# Altium project TC364_MainBoard_V1.3.PrjPcb
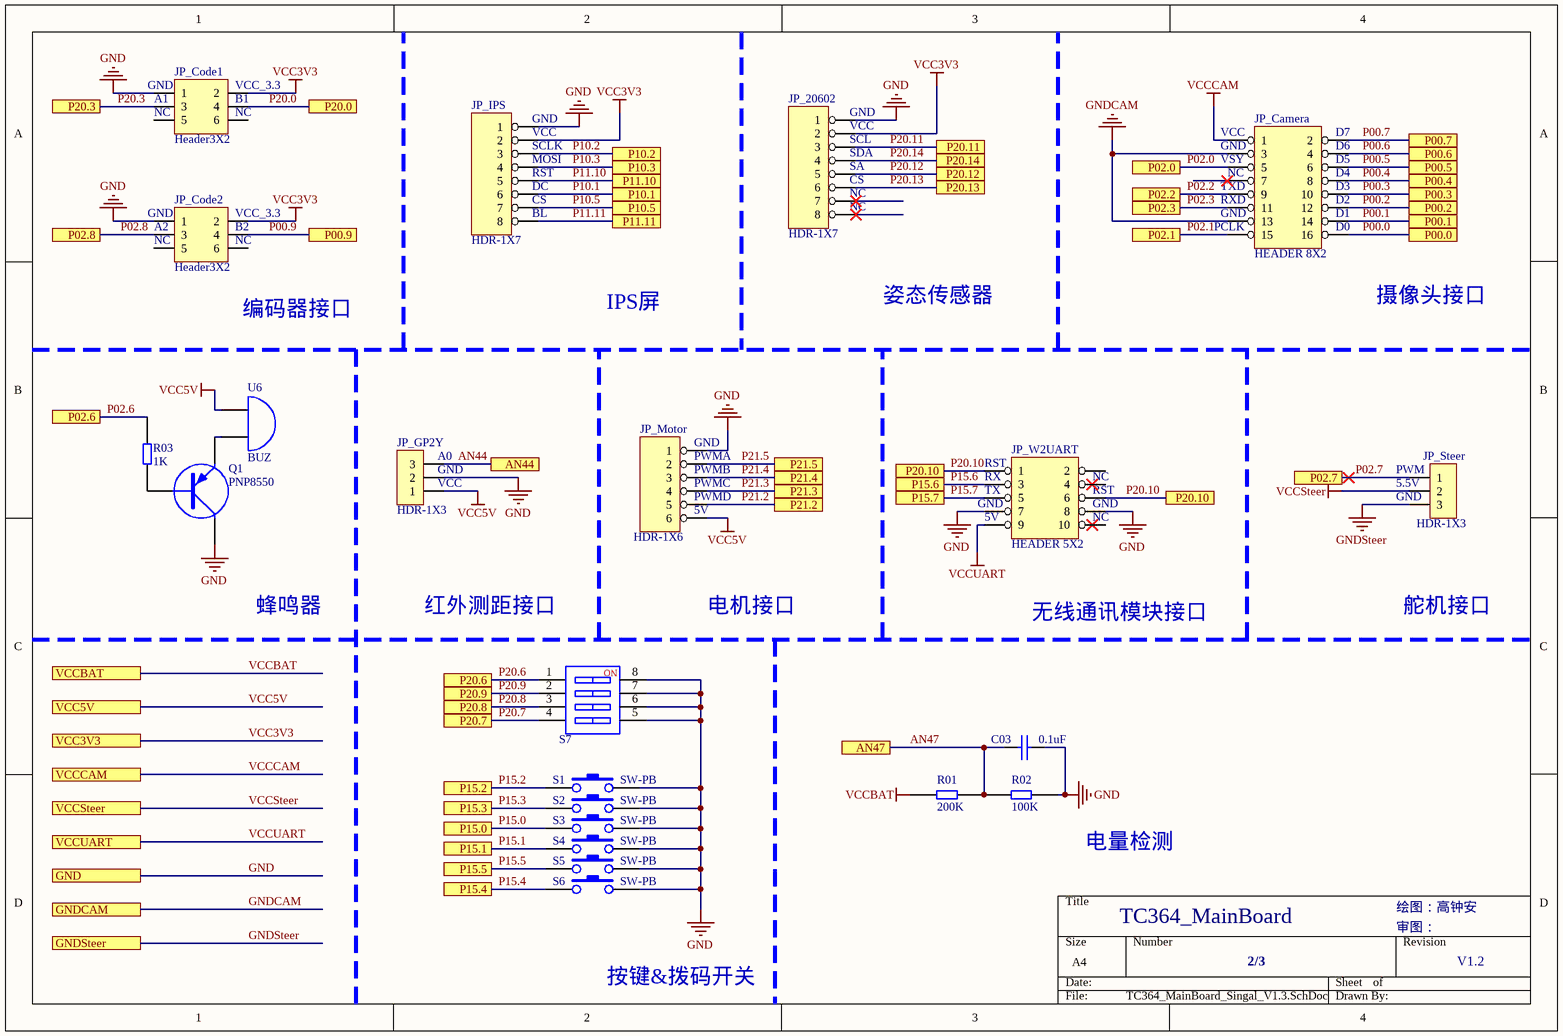
[diagram p0: TC364_MainBoard_Singal_V1.3.SchDoc]
2 sheets, 78 parts. Net scope: flat (ports and power ports of the same name join across sheets).
Board file: (Poly)TC364_MainBoard_PCB_V1.3.PcbDoc
Sheets:
  TC364_MainBoard_Singal_V1.3.SchDoc
  TC364_MainBoard_Power_V1.3.SchDoc

## Sheet TC364_MainBoard_Singal_V1.3.SchDoc
size A4

### Parts
C03  0.1uF  [0805C]
JP_20602  HDR-1X7  [SIP8]
JP_Camera  HEADER 8X2  [IDC16-JLC - duplicate]
JP_Code1  Header3X2  [HDR2.54-LI-2x3P]
JP_Code2  Header3X2  [HDR2.54-LI-2x3P]
JP_GP2Y  HDR-1X3  [SIP3N]
JP_IPS  HDR-1X7  [SIP8]
JP_Motor  HDR-1X6  [SIP6N]
JP_Steer  HDR-1X3  [HDR2.54-LI-3P]
JP_W2UART  HEADER 5X2  [IDC10-JLC]
Q1  PNP8550  [PNP8550-SO]
R01  200K  [0805R]
R02  100K  [0805R]
R03  1K  [0805R]
S1  SW-PB  [KEY2-6X3]
S2  SW-PB  [KEY2-6X3]
S3  SW-PB  [KEY2-6X3]
S4  SW-PB  [KEY2-6X3]
S5  SW-PB  [KEY2-6X3]
S6  SW-PB  [KEY2-6X3]
S7  SW-4P  [CSW DIP-4P]  (value not drawn)
U6  BUZ  [BUZ]

### Ports
AN44, AN47, GND, GNDCAM, GNDSteer, P00.0, P00.1, P00.2, P00.3, P00.4, P00.5, P00.6, P00.7, P00.9, P02.0, P02.1, P02.2, P02.3, P02.6, P02.7, P02.8, P10.1, P10.2, P10.3, P10.5, P11.10, P11.11, P15.0, P15.1, P15.2, P15.3, P15.4, P15.5, P15.6, P15.7, P20.0, P20.3, P20.6, P20.7, P20.8, P20.9, P20.10, P20.11, P20.12, P20.13, P20.14, P21.2, P21.3, P21.4, P21.5, VCC3V3, VCC5V, VCCBAT, VCCCAM, VCCSteer, VCCUART

### Nets
GND: C03.2 JP_20602.1 JP_Code1.1 JP_Code2.1 JP_GP2Y.2 JP_IPS.1 JP_Motor.1 JP_W2UART.7 JP_W2UART.8 Q1.3(C) R02.1 S1.2 S2.2 S3.2 S4.2 S5.2 S6.2 S7.5 S7.6 S7.7 S7.8 ; port GND
GNDCAM: JP_Camera.3 JP_Camera.13 ; port GNDCAM
GNDSteer: JP_Steer.3 ; port GNDSteer
VCC3V3: JP_20602.2 JP_Code1.2 JP_Code2.2 JP_IPS.2 ; port VCC3V3
VCC5V: JP_GP2Y.1 JP_Motor.6 U6.1(A) ; port VCC5V
VCCBAT: R01.2 ; port VCCBAT
VCCCAM: JP_Camera.1 ; port VCCCAM
VCCSteer: JP_Steer.2 ; port VCCSteer
VCCUART: JP_W2UART.9 ; port VCCUART
AN44: JP_GP2Y.3 ; port AN44
AN47: C03.1 R01.1 R02.2 ; port AN47
P00.0: JP_Camera.16 ; port P00.0
P00.1: JP_Camera.14 ; port P00.1
P00.2: JP_Camera.12 ; port P00.2
P00.3: JP_Camera.10 ; port P00.3
P00.4: JP_Camera.8 ; port P00.4
P00.5: JP_Camera.6 ; port P00.5
P00.6: JP_Camera.4 ; port P00.6
P00.7: JP_Camera.2 ; port P00.7
P00.9: JP_Code2.4 ; port P00.9
P02.0: JP_Camera.5 ; port P02.0
P02.1: JP_Camera.15 ; port P02.1
P02.2: JP_Camera.9 ; port P02.2
P02.3: JP_Camera.11 ; port P02.3
P02.6: R03.1 ; port P02.6
P02.7: JP_Steer.1 ; port P02.7
P02.8: JP_Code2.3 ; port P02.8
P10.1: JP_IPS.6 ; port P10.1
P10.2: JP_IPS.3 ; port P10.2
P10.3: JP_IPS.4 ; port P10.3
P10.5: JP_IPS.7 ; port P10.5
P11.10: JP_IPS.5 ; port P11.10
P11.11: JP_IPS.8 ; port P11.11
P15.0: S3.1 ; port P15.0
P15.1: S4.1 ; port P15.1
P15.2: S1.1 ; port P15.2
P15.3: S2.1 ; port P15.3
P15.4: S6.1 ; port P15.4
P15.5: S5.1 ; port P15.5
P15.6: JP_W2UART.3 ; port P15.6
P15.7: JP_W2UART.5 ; port P15.7
P20.0: JP_Code1.4 ; port P20.0
P20.3: JP_Code1.3 ; port P20.3
P20.6: S7.1 ; port P20.6
P20.7: S7.4 ; port P20.7
P20.8: S7.3 ; port P20.8
P20.9: S7.2 ; port P20.9
P20.10: JP_W2UART.1 JP_W2UART.6 ; port P20.10
P20.11: JP_20602.3 ; port P20.11
P20.12: JP_20602.5 ; port P20.12
P20.13: JP_20602.6 ; port P20.13
P20.14: JP_20602.4 ; port P20.14
P21.2: JP_Motor.5 ; port P21.2
P21.3: JP_Motor.4 ; port P21.3
P21.4: JP_Motor.3 ; port P21.4
P21.5: JP_Motor.2 ; port P21.5
NetQ1_1: Q1.1(B) R03.2
NetQ1_2: Q1.2(E) U6.2(B)

Not connected (* = marked no-connect by the designer): JP_20602 7* 8*; JP_Camera 7*; JP_Code1 5 6; JP_Code2 5 6; JP_W2UART 2 4 10

### Notes on the sheet
- (near JP_Code1) GND
- (near JP_Code1) A1
- (near JP_Code1) NC
- (near JP_Code1) B1
- (near JP_Code1) VCC_3.3
- (near JP_20602) GND
- (near JP_IPS) VCC
- (near JP_IPS) SCLK
- (near JP_IPS) MOSI
- (near JP_IPS) RST
- (near JP_IPS) GND
- (near JP_20602) VCC
- (near JP_20602) SCL
- (near JP_20602) SDA
- (near JP_20602) SA
- (near JP_Camera) GND
- (near JP_Camera) VSY
- (near JP_Camera) VCC
- (near JP_Camera) NC
- (near JP_Camera) D4
- (near JP_Camera) D5
- (near JP_Camera) D6
- (near JP_Camera) D7
- (near JP_Code2) GND
- (near JP_Code2) A2
- (near JP_Code2) NC
- (near JP_Code2) B2
- (near JP_Code2) VCC_3.3
- (near JP_IPS) DC
- (near JP_IPS) CS
- (near JP_IPS) BL
- (near JP_20602) NC
- (near JP_20602) CS
- (near JP_Camera) PCLK
- (near JP_Camera) TXD
- (near JP_Camera) RXD
- (near JP_Camera) D0
- (near JP_Camera) D1
- (near JP_Camera) D2
- (near JP_Camera) D3
- IPS屏
- 姿态传感器
- 摄像头接口
- (near JP_Code2) 编码器接口
- (near JP_Motor) GND
- (near JP_GP2Y) A0
- (near JP_GP2Y) GND
- (near JP_GP2Y) VCC
- (near JP_Motor) 5V
- (near JP_Motor) PWMA
- (near JP_Motor) PWMB
- (near JP_Motor) PWMC
- (near JP_Motor) PWMD
- (near JP_W2UART) GND
- (near JP_W2UART) TX
- (near JP_W2UART) RX
- (near JP_W2UART) 5V
- (near JP_W2UART) RST
- (near JP_W2UART) NC
- (near JP_Steer) PWM
- (near JP_Steer) GND
- (near JP_Steer) 5.5V
- 蜂鸣器
- 红外测距接口
- 电机接口
- 无线通讯模块接口
- 舵机接口
- 电量检测
- TC364_MainBoard
- 绘图：高钟安
- 按键&拨码开关
- 2/3
- 审图：
- V1.2
- (in symbol SW-4P) NO

### Library data of the parts
C03 = CAP: Capacitor
JP_20602 JP_IPS = HEADER 8: 8 Pin Header
JP_Code1 JP_Code2 = Header 3X2: 3*2P接插件; 版权归属: 封装库来自淘宝 ID：黄晶宝石; BOM名称: 3*2P接插件; 学习资源: https://shop463601444.taobao.com
JP_GP2Y JP_Steer = Header 3: 3P接插件; 版权归属: 封装库来自淘宝 ID：黄晶宝石; BOM名称: 3P接插件; 学习资源: https://shop463601444.taobao.com
JP_Motor = HEADER 6
Q1 = PNP: PNP Transistor
R01 R02 R03 = RES
S1-S6 = SW-PB: 按键
S7 = SW-4P: 4路编码开关; 淘宝ID: 封装库来自淘宝 ID：黄晶宝石; BOM名称: 4路编码开关; 学习资源: https://shop463601444.taobao.com
U6 = BELL

## Sheet TC364_MainBoard_Power_V1.3.SchDoc
size A4
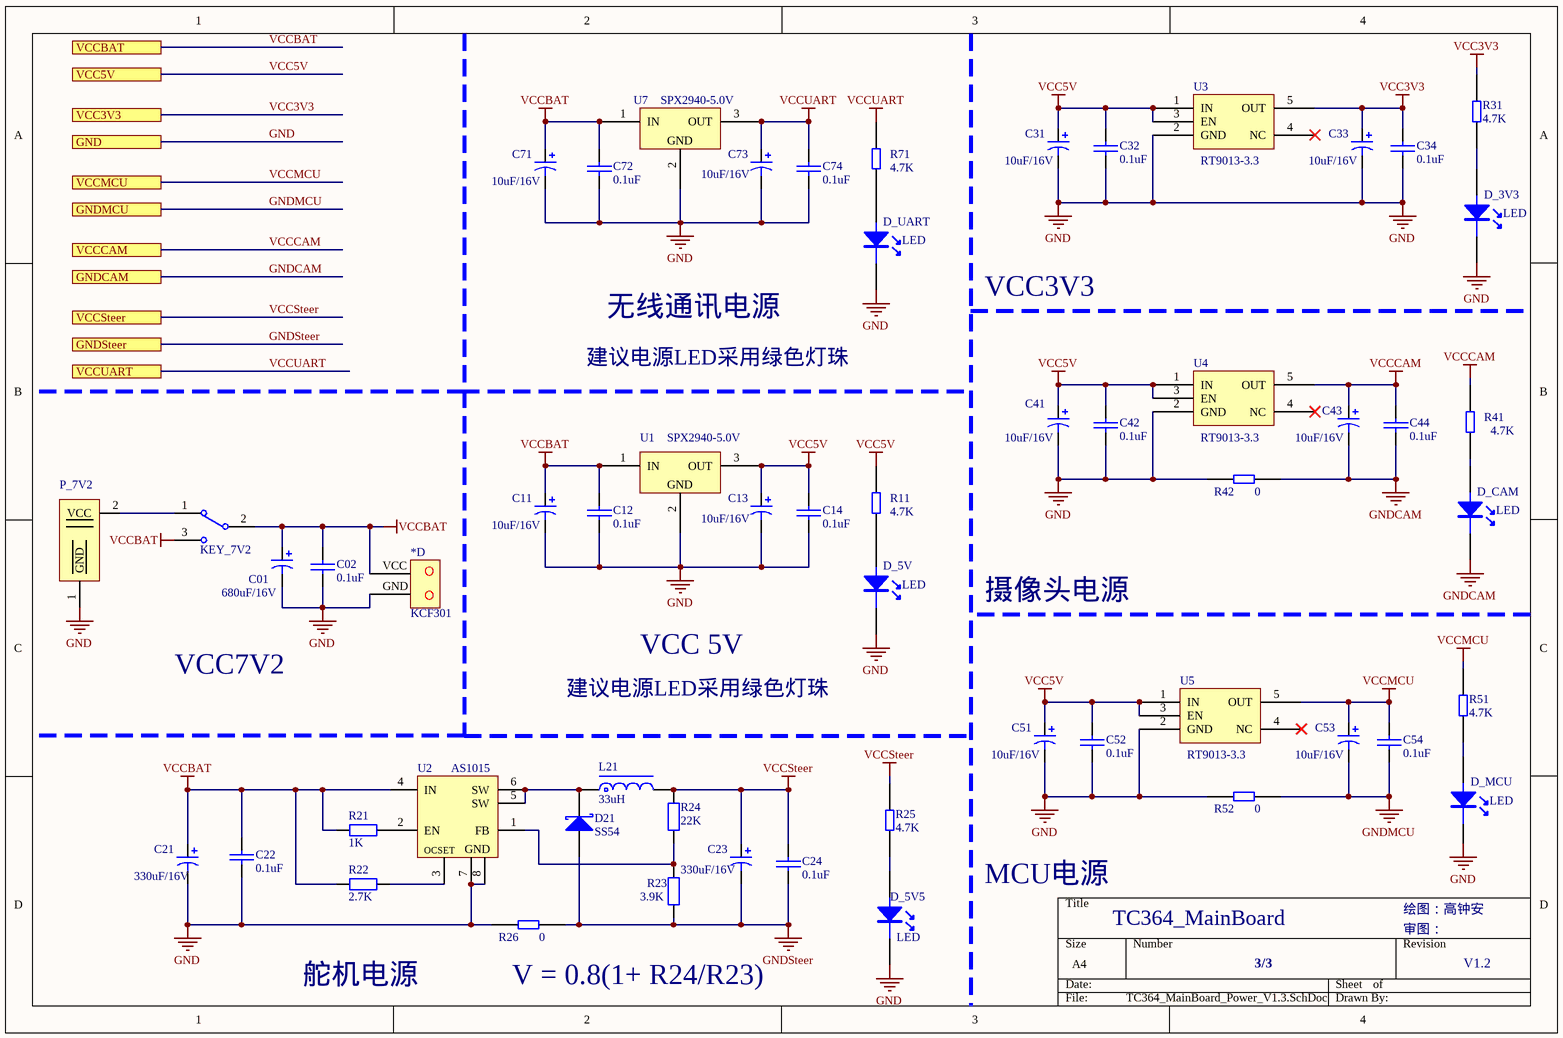
[diagram p1: TC364_MainBoard_Power_V1.3.SchDoc]

### Parts
*  KCF301  [KF301-2P]  (part D of 4)
C01  680uF/16V  [CAP 3.5*8*11.5 - GD]
C02  0.1uF  [0805C]
C11  10uF/16V  [CASE-A_3216]
C12  0.1uF  [0805C]
C13  10uF/16V  [CASE-A_3216]
C14  0.1uF  [0805C]
C21  330uF/16V  [CAP 2.5*6.3*11.2 - BK]
C22  0.1uF  [0805C]
C23  330uF/16V  [CAP 2.5*6.3*11.2 - BK]
C24  0.1uF  [0805C]
C31  10uF/16V  [CASE-A_3216]
C32  0.1uF  [0805C]
C33  10uF/16V  [CASE-A_3216]
C34  0.1uF  [0805C]
C41  10uF/16V  [CASE-A_3216]
C42  0.1uF  [0805C]
C43  10uF/16V  [CASE-A_3216]
C44  0.1uF  [0805C]
C51  10uF/16V  [CASE-A_3216]
C52  0.1uF  [0805C]
C53  10uF/16V  [CASE-A_3216]
C54  0.1uF  [0805C]
C71  10uF/16V  [CASE-A_3216]
C72  0.1uF  [0805C]
C73  10uF/16V  [CASE-A_3216]
C74  0.1uF  [0805C]
D21  SS54  [SMA]
D_3V3  LED  [0805_LED_S1]
D_5V  LED  [0805_LED_S1]
D_5V5  LED  [0805_LED_S1]
D_CAM  LED  [0805_LED_S1]
D_MCU  LED  [0805_LED_S1]
D_UART  LED  [0805_LED_S1]
KEY_7V2  SS-12F23  [KEY_7V2]  (value not drawn)
L21  33uH  [7*7 L]
P_7V2  T_Type_Adapter  [T_Type_Adapter]  (value not drawn)
R11  4.7K  [0805R]
R21  1K  [0805R]
R22  2.7K  [0805R]
R23  3.9K  [0805R]
R24  22K  [0805R]
R25  4.7K  [0805R]
R26  0  [0805R]
R31  4.7K  [0805R]
R41  4.7K  [0805R]
R42  0  [0805R]
R51  4.7K  [0805R]
R52  0  [0805R]
R71  4.7K  [0805R]
U1  SPX2940-5.0V  [TO-220(TO-220-3)]
U2  AS1015  [SOP-8_150mil]
U3  RT9013-3.3  [SOT-23-5]
U4  RT9013-3.3  [SOT-23-5]
U5  RT9013-3.3  [SOT-23-5]
U7  SPX2940-5.0V  [TO-220(TO-220-3)]

### Ports
GND, GNDCAM, GNDMCU, GNDSteer, VCC3V3, VCC5V, VCCBAT, VCCCAM, VCCMCU, VCCSteer, VCCUART

### Nets
GND: C01.2 C02.2 C11.2 C12.2 C13.2 C14.2 C21.2 C22.2 C31.2 C32.2 C33.2 C34.2 C41.2 C42.2 C51.2 C52.2 C71.2 C72.2 C73.2 C74.2 D_3V3.K D_5V.K D_5V5.K D_UART.K P_7V2.1(GND) R26.2 R42.2 R52.2 U1.2(GND) U2.7(GND) U2.8(GND) U3.2(GND) U4.2(GND) U5.2(GND) U7.2(GND) ; port GND
GNDCAM: C43.2 C44.2 D_CAM.K R42.1 ; port GNDCAM
GNDMCU: C53.2 C54.2 R52.1 ; port GNDMCU
GNDSteer: C23.2 C24.2 D21.1(A) R23.2 R26.1 ; port GNDSteer
VCC3V3: C33.1 C34.1 R31.1 U3.5(OUT) ; port VCC3V3
VCC5V: C13.1 C14.1 C31.1 C32.1 C41.1 C42.1 C51.1 C52.1 R11.1 U1.3(OUT) U3.1(IN) U3.3(EN) U4.1(IN) U4.3(EN) U5.1(IN) U5.3(EN) ; port VCC5V
VCCBAT: C01.1 C02.1 C11.1 C12.1 C21.1 C22.1 C71.1 C72.1 KEY_7V2.2 KEY_7V2.3 R21.2 R22.2 U1.1(IN) U2.4(IN) U7.1(IN) ; port VCCBAT
VCCCAM: C43.1 C44.1 R41.1 U4.5(OUT) ; port VCCCAM
VCCMCU: C53.1 C54.1 R51.1 U5.5(OUT) ; port VCCMCU
VCCSteer: C23.1 C24.1 L21.2 R24.1 R25.1 ; port VCCSteer
VCCUART: C73.1 C74.1 R71.1 U7.3(OUT) ; port VCCUART
NetD21_2: D21.2(K) L21.1 U2.5(SW) U2.6(SW)
NetD_3V3_A: D_3V3.A R31.2
NetD_5V5_A: D_5V5.A R25.2
NetD_5V_A: D_5V.A R11.2
NetD_CAM_A: D_CAM.A R41.2
NetD_MCU_A: D_MCU.A R51.2
NetD_UART_A: D_UART.A R71.2
NetKEY_7V2_1: KEY_7V2.1 P_7V2.2(VCC)
NetR21_1: R21.1 U2.2(EN)
NetR22_1: R22.1 U2.3(OCSET)
NetR23_1: R23.1 R24.2 U2.1(FB)

Not connected (* = marked no-connect by the designer): * GND(1) VCC(0); D_MCU K(2); U3 4(NC)*; U4 4(NC)*; U5 4(NC)*

### Notes on the sheet
- VCC3V3
- 建议电源LED采用绿色灯珠
- 无线通讯电源
- VCC 5V
- 摄像头电源
- VCC7V2
- MCU电源
- TC364_MainBoard
- 绘图：高钟安
- 舵机电源
- V = 0.8(1+ R24/R23)
- 3/3
- 审图：
- V1.2
- Labels drawn without touching a wire or pin: GND

### Library data of the parts
C01 C11 C13 C21 C23 C31 C33 C41 C43 C51 C53 C71 C73 = Cap Pol1: Polarized Capacitor (Radial); Published: 8-Jun-2000; LatestRevisionDate: 17-Jul-2002; LatestRevisionNote: Re-released for DXP Platform.; PackageReference: RB7.6-15; Publisher: Altium Limited; PackageDescription: Polarized Capacitor (Radial); 2 Leads
C02 C12 C14 C22 C24 C32 C34 C42 C44 C52 C54 C72 C74 = CAP: Capacitor
D21 = SS34: 肖特基二极管; 属性: 40V/3A; BOM名称: 肖特基二极管; 封装库来自淘宝 ID：黄晶宝石: https://shop463601444.taobao.com
D_3V3 D_5V D_5V5 D_CAM D_MCU D_UART = LED: 发光二极管
KEY_7V2 = SSW-1P: 1路波动开关; BOM名称: 波动开关; 版权归属: 封装库来自淘宝 ID：黄晶宝石; 学习资源: www.ooocke.com
L21 = L-CDRH: 功率屏蔽电感; 版权归属: 封装库来自淘宝 ID：黄晶宝石; BOM名称: 功率屏蔽电感; 联系售后: https://shop463601444.taobao.com
R11 R25 R26 R31 R41 R42 R51 R52 R71 = RES
R21-R24 = RES: 贴片电阻; 版权归属: 源创客; BOM名称: 贴片电阻; 学习资源: www.ooocke.com
U1 U7 = LM2940: 5V稳压芯片; 版权归属: 封装库来自淘宝 ID：黄晶宝石; BOM名称: 5V稳压芯片; 联系售后: www.ooocke.com
U2 = AS1015: 可调升压芯片

## Nets that join several sheets
GND: TC364_MainBoard_Singal_V1.3 (21 pins), TC364_MainBoard_Power_V1.3 (35 pins)
GNDCAM: TC364_MainBoard_Singal_V1.3 (JP_Camera.3 JP_Camera.13), TC364_MainBoard_Power_V1.3 (C43.2 C44.2 D_CAM.K R42.1)
GNDSteer: TC364_MainBoard_Singal_V1.3 (JP_Steer.3), TC364_MainBoard_Power_V1.3 (5 pins)
VCC3V3: TC364_MainBoard_Singal_V1.3 (JP_20602.2 JP_Code1.2 JP_Code2.2 JP_IPS.2), TC364_MainBoard_Power_V1.3 (C33.1 C34.1 R31.1 U3.5)
VCC5V: TC364_MainBoard_Singal_V1.3 (JP_GP2Y.1 JP_Motor.6 U6.1), TC364_MainBoard_Power_V1.3 (16 pins)
VCCBAT: TC364_MainBoard_Singal_V1.3 (R01.2), TC364_MainBoard_Power_V1.3 (15 pins)
VCCCAM: TC364_MainBoard_Singal_V1.3 (JP_Camera.1), TC364_MainBoard_Power_V1.3 (C43.1 C44.1 R41.1 U4.5)
VCCSteer: TC364_MainBoard_Singal_V1.3 (JP_Steer.2), TC364_MainBoard_Power_V1.3 (5 pins)
VCCUART: TC364_MainBoard_Singal_V1.3 (JP_W2UART.9), TC364_MainBoard_Power_V1.3 (C73.1 C74.1 R71.1 U7.3)